# Altium schematic sheet 04_Power.SchDoc: =GlobalProjectName
size 594 x 420 mm; CheckedBy: A_D; Author: A_D; SheetNumber: 4; SheetTotal: 4; PageSetup: Record=PageOptions|CenterHorizontal=True|CenterVertical=True|PrintScale=0.70|XCorrection=1.00|YCorrection=1.00|PrintKind=2|BorderSize=5000000|LeftOffset=9000|BottomOffset=10100|Orientation=2|PaperLength=11176|PaperWidth=8636|Scale=100|PaperSource=259|PrintQuality=-3|MediaType=1|DitherType=10|PrintScaleMode=1|PaperKind=A3|PaperIndex=8
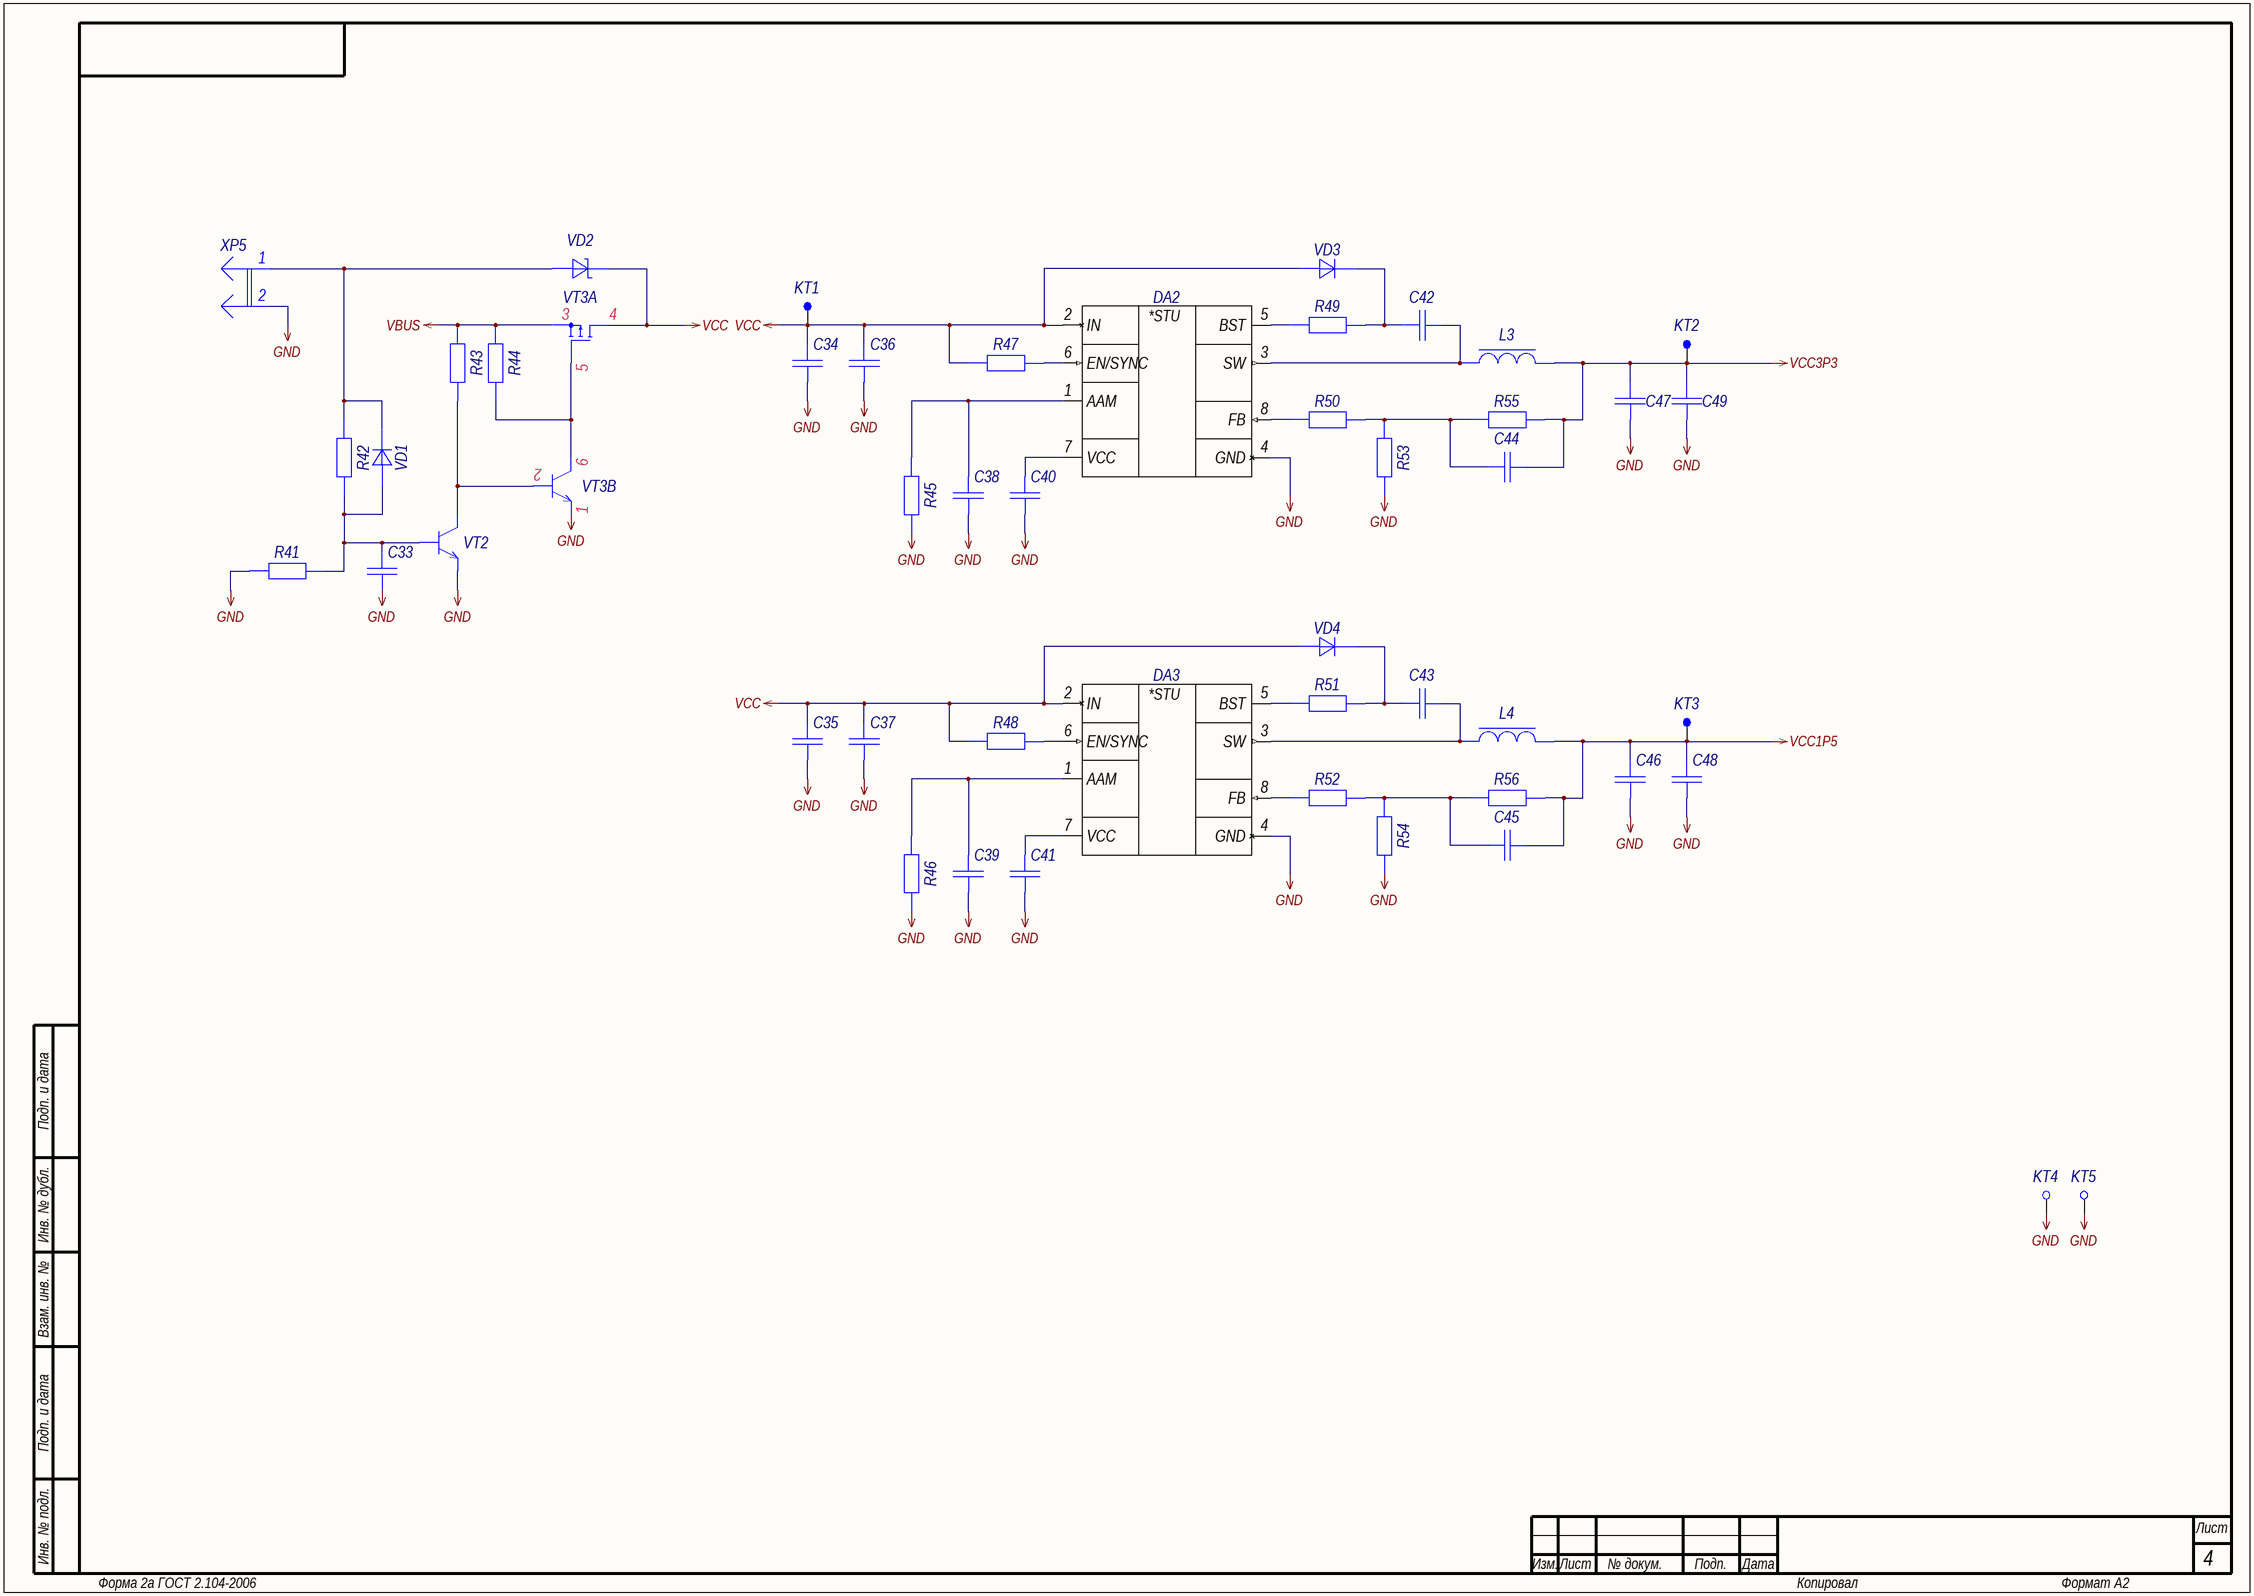
[diagram p0: 04_Power.SchDoc]

## Parts
C33  Capacitor  [C0603_L]  (value not drawn)
C34  Capacitor  [C1206_L]  (value not drawn)
C35  Capacitor  [C1206_L]  (value not drawn)
C36  Capacitor  [C0603_L]  (value not drawn)
C37  Capacitor  [C0603_L]  (value not drawn)
C38  Capacitor  [C0603_L]  (value not drawn)
C39  Capacitor  [C0603_L]  (value not drawn)
C40  Capacitor  [C0603_L]  (value not drawn)
C41  Capacitor  [C0603_L]  (value not drawn)
C42  Capacitor  [C0603_L]  (value not drawn)
C43  Capacitor  [C0603_L]  (value not drawn)
C44  Capacitor  [C0603_L]  (value not drawn)
C45  Capacitor  [C0603_L]  (value not drawn)
C46  Capacitor  [C0805_L]  (value not drawn)
C47  Capacitor  [C0805_L]  (value not drawn)
C48  Capacitor  [C0805_L]  (value not drawn)
C49  Capacitor  [C0805_L]  (value not drawn)
DA2  MP2315GJ  [TSOT-23-8_065P290X160X100_N]  (value not drawn)
DA3  MP2315GJ  [TSOT-23-8_065P290X160X100_N]  (value not drawn)
KT1  VCC  [TP-SMT-C-0.8mm]  (value not drawn)  (no BOM)
KT2  +3.3В  [TP-SMT-C-0.8mm]  (value not drawn)  (no BOM)
KT3  +1.5V  [TP-SMT-C-0.8mm]  (value not drawn)  (no BOM)
KT4  ОБЩ  [5001]  (value not drawn)  (no BOM)
KT5  ОБЩ  [5001]  (value not drawn)  (no BOM)
L3  Coil  [SRP4020TA-Series]  (value not drawn)
L4  Coil  [SRP4020TA-Series]  (value not drawn)
R41  Resistor  [R0603_L]  (value not drawn)
R42  Resistor  [R0603_L]  (value not drawn)
R43  Resistor  [R0603_L]  (value not drawn)
R44  Resistor  [R0603_L]  (value not drawn)
R45  Resistor  [R0603_L]  (value not drawn)
R46  Resistor  [R0603_L]  (value not drawn)
R47  Resistor  [R0603_L]  (value not drawn)
R48  Resistor  [R0603_L]  (value not drawn)
R49  Resistor  [R0603_L]  (value not drawn)
R50  Resistor  [R0603_L]  (value not drawn)
R51  Resistor  [R0603_L]  (value not drawn)
R52  Resistor  [R0603_L]  (value not drawn)
R53  Resistor  [R0603_L]  (value not drawn)
R54  Resistor  [R0603_L]  (value not drawn)
R55  Resistor  [R0603_L]  (value not drawn)
R56  Resistor  [R0603_L]  (value not drawn)
VD1  Diode  [SOD-323]  (value not drawn)
VD2  Schottky  [SOD-123]  (value not drawn)
VD3  Diode  [SOD-323]  (value not drawn)
VD4  Diode  [SOD-323]  (value not drawn)
VT2  BJT-NPN  [SOT-23_190P290X160X145_N]  (value not drawn)
VT3  PMC85XP  [SOT-1118-2M_065P200X200X065_N]  (value not drawn)  (parts A,B of 2)
XP5  VCC  [MW-2M]  (value not drawn)

## Nets
GND: C33.1 C34.1 C35.1 C36.1 C37.1 C38.1 C39.1 C40.1 C41.1 C46.1 C47.1 C48.1 C49.1 DA2.4(GND) DA3.4(GND) KT4.1 KT5.1 R41.2 R45.1 R46.1 R53.1 R54.1 VT2.3(Э) VT3.1(Э) XP5.2
VBUS: R43.2 R44.2 VT3.3(S)
VCC: C34.2 C35.2 C36.2 C37.2 DA2.2(IN) DA3.2(IN) KT1.1 R47.1 R48.1 VD2.2(К) VD3.1(А) VD4.1(А) VT3.4(D)
VCC1P5: C45.2 C46.2 C48.2 KT3.1 L4.2 R56.2
VCC3P3: C44.2 C47.2 C49.2 KT2.1 L3.2 R55.2
NetC33_2: C33.2 R41.1 R42.1 VD1.1(А) VT2.1(Б)
NetC38_2: C38.2 DA2.1(AAM) R45.2
NetC39_2: C39.2 DA3.1(AAM) R46.2
NetC40_2: C40.2 DA2.7(VCC)
NetC41_2: C41.2 DA3.7(VCC)
NetC42_1: C42.1 R49.2 VD3.2(К)
NetC42_2: C42.2 DA2.3(SW) L3.1
NetC43_1: C43.1 R51.2 VD4.2(К)
NetC43_2: C43.2 DA3.3(SW) L4.1
NetC44_1: C44.1 R50.2 R53.2 R55.1
NetC45_1: C45.1 R52.2 R54.2 R56.1
NetDA2_5: DA2.5(BST) R49.1
NetDA2_6: DA2.6(EN/SYNC) R47.2
NetDA2_8: DA2.8(FB) R50.1
NetDA3_5: DA3.5(BST) R51.1
NetDA3_6: DA3.6(EN/SYNC) R48.2
NetDA3_8: DA3.8(FB) R52.1
NetR42_2: R42.2 VD1.2(К) VD2.1(А) XP5.1
NetR43_1: R43.1 VT2.2(К) VT3.2(Б)
NetR44_1: R44.1 VT3.5(G) VT3.6(К)

## Notes on the sheet
- Подп. и дата
- Инв. № дубл.
- Взам. инв. №
- Инв. № подл.
- Изм.
- Лист
- № докум.
- Подп.
- Дата
- Форма 2а ГОСТ 2.104-2006
- Копировал
- Формат А2
- (in symbol MP2315GJ-Z) *STU

## Library data of the parts
C33 C36 C37 C40-C43 = GRM188R72A104KA35D: Manufacturer: Murata; Type: Конденсатор; ID: 232; Value: 0.1uF; Voltage: 100V; Tolerance: ±10%; Dielectric Type: X7R; Application Category: 1; Working Temperature Min: -55°С; Working Temperature Max: +125°С; Published: 18.05.2010; Publisher: Andrew Danich; Part Number: GRM188R72A104KA35D; Footprint: 0603
  C36 C37 C42 C43: ClassName: DirectConnect
C34 C35 = GRM31CR71A226KE15L: Manufacturer: Murata; Type: Конденсатор; ID: 238; Value: 22uF; Voltage: 10V; Tolerance: ±10%; Dielectric Type: X7R; Application Category: 1; Working Temperature Min: -55°С; Working Temperature Max: +125°С; Published: 18.05.2010; Publisher: Andrew Danich; Part Number: GRM31CR71A226KE15L; Footprint: 1206; ClassName: DirectConnect
C38 C39 = GRM1885C2A102JA01D: Manufacturer: Murata; Type: Конденсатор; ID: 135; Value: 1000pF; Voltage: 100V; Tolerance: ±5%; Dielectric Type: NP0; Application Category: 1; Working Temperature Min: -55°С; Working Temperature Max: +125°С; Published: 18.05.2010; Publisher: Andrew Danich; Part Number: GRM1885C2A102JA01D; Footprint: 0603
C44 C45 = GRM1885C1H330JA01D: Manufacturer: Murata; Type: Конденсатор; ID: 123; Value: 33pF; Voltage: 50V; Tolerance: ±5%; Dielectric Type: NP0; Application Category: 1; Working Temperature Min: -55°С; Working Temperature Max: +125°С; Published: 18.05.2010; Publisher: Andrew Danich; Part Number: GRM1885C1H330JA01D; Footprint: 0603
C46-C49 = GRM21BR60J226ME39L: Manufacturer: Murata; Type: Конденсатор; ID: 140; Value: 22uF; Voltage: 6.3V; Tolerance: ±20%; Dielectric Type: X5R; Application Category: 1; Working Temperature Min: -55°С; Working Temperature Max: +85°С; Published: 18.05.2010; Publisher: Andrew Danich; Part Number: GRM21BR60J226ME39L; Footprint: 0805; ClassName: DirectConnect
DA2 DA3 = MP2315GJ-Z: Manufacturer: Monolithic Power Systems; ID: 38; Input Voltage: +4.5…24V; Output Current: 3A; Output Voltage: +0.8…22.8V; Shutdown Input: YES; Frequency: 500kHz; Application Category: 1; Working Temperature Min: -40°С; Working Temperature Max: +125°С; Functional Analog: MP2315GJ-P; Type: Микросхема; Published: 01.09.2018; Publisher: Andrew Danich; Part Number: MP2315GJ-Z; Value: MP2315GJ-Z; ClassName: DirectConnect
KT1-KT3 = TestPoint-SMT: ID: 6; Application Type: On PCB Test Point; Application Category: 1; Published: 03.03.2015; Publisher: Andrew Danich; Part Number: TestPoint-SMT; Value: TestPoint-SMT; Manufacturer: -; Functional Analog: -
KT4 KT5 = 5001: Manufacturer: Keystone Electronics; ID: 2; Value: 5001; Limit Voltage: 100V; Rated Current: 0.5A; Application Type: Miniature THM Test Point; Application Category: 1; Published: 03.03.2015; Publisher: Andrew Danich; Part Number: 5001; Functional Analog: -
L3 L4 = SRP4020TA-4R7M: Manufacturer: Bourns; Type: Дроссель; ID: 103; Rated Current: 2.6A; Tolerance: ±20%; Inductance: 4.7uH; Q: 10; DC Resistance: 0.105ohm; Self-Resonant Frequency: 27MHz; Application Category: 1; Working Temperature Min: -40°С; Working Temperature Max: +125°С; Published: 20.05.2010; Publisher: Andrew Danich; Part Number: SRP4020TA-4R7M; Value: SRP4020TA-4R7M; Footprint: SRP4020TA; ClassName: DirectConnect
R41-R44 = RC0603JR-0710KL: Manufacturer: Yageo; ID: 12; Value: 10k; Limit Voltage: 50V; Tolerance: ±5%; Temperature Coefficient: 100ppm; Total Power Dissipation: 0.1W; Series Type: Thick-Film; Application Category: 1; Working Temperature Min: -55°С; Working Temperature Max: +155°С; Functional Analog: CR0603-JW-103E; Published: 24.03.2010; Publisher: Andrew Danich; Type: Резистор; Part Number: RC0603JR-0710KL; Footprint: 0603
R45 R46 = RC0603JR-0762KL: Manufacturer: Yageo; ID: 74; Value: 62k; Limit Voltage: 50V; Tolerance: ±5%; Temperature Coefficient: 100ppm; Total Power Dissipation: 0.1W; Series Type: Thick-Film; Application Category: 1; Working Temperature Min: -55°С; Working Temperature Max: +155°С; Published: 24.03.2010; Publisher: Andrew Danich; Type: Резистор; Part Number: RC0603JR-0762KL; Footprint: 0603
R47 R48 = RC0603JR-07100KL: Manufacturer: Yageo; ID: 11; Value: 100k; Limit Voltage: 50V; Tolerance: ±5%; Temperature Coefficient: 100ppm; Total Power Dissipation: 0.1W; Series Type: Thick-Film; Application Category: 1; Working Temperature Min: -55°С; Working Temperature Max: +155°С; Functional Analog: CR0603-JW-104E; Published: 24.03.2010; Publisher: Andrew Danich; Type: Резистор; Part Number: RC0603JR-07100KL; Footprint: 0603
R49 R51 = RC0603JR-0722RL: Manufacturer: Yageo; ID: 29; Value: 22; Limit Voltage: 50V; Tolerance: ±5%; Temperature Coefficient: 100ppm; Total Power Dissipation: 0.1W; Series Type: Thick-Film; Application Category: 1; Working Temperature Min: -55°С; Working Temperature Max: +155°С; Published: 24.03.2010; Publisher: Andrew Danich; Type: Резистор; Part Number: RC0603JR-0722RL; Footprint: 0603
R50 R52 = RC0603JR-0733KL: Manufacturer: Yageo; ID: 47; Value: 33k; Limit Voltage: 50V; Tolerance: ±5%; Temperature Coefficient: 100ppm; Total Power Dissipation: 0.1W; Series Type: Thick-Film; Application Category: 1; Working Temperature Min: -55°С; Working Temperature Max: +155°С; Published: 24.03.2010; Publisher: Andrew Danich; Type: Резистор; Part Number: RC0603JR-0733KL; Footprint: 0603
R53 = RC0603FR-0712K7L: Manufacturer: Yageo; ID: 263; Value: 12.7k; Limit Voltage: 50V; Tolerance: ±1%; Temperature Coefficient: 100ppm; Total Power Dissipation: 0.1W; Series Type: Thick-Film; Application Category: 1; Working Temperature Min: -55°С; Working Temperature Max: +155°С; Published: 24.03.2010; Publisher: Andrew Danich; Type: Резистор; Part Number: RC0603FR-0712K7L; Footprint: 0603
R54 = RC0603FR-0746K4L: Manufacturer: Yageo; ID: 298; Value: 46.4k; Limit Voltage: 50V; Tolerance: ±1%; Temperature Coefficient: 100ppm; Total Power Dissipation: 0.1W; Series Type: Thick-Film; Application Category: 1; Working Temperature Min: -55°С; Working Temperature Max: +155°С; Published: 24.03.2010; Publisher: Andrew Danich; Type: Резистор; Part Number: RC0603FR-0746K4L; Footprint: 0603
R55 R56 = RC0603FR-0740K2L: Manufacturer: Yageo; ID: 294; Value: 40.2k; Limit Voltage: 50V; Tolerance: ±1%; Temperature Coefficient: 100ppm; Total Power Dissipation: 0.1W; Series Type: Thick-Film; Application Category: 1; Working Temperature Min: -55°С; Working Temperature Max: +155°С; Published: 24.03.2010; Publisher: Andrew Danich; Type: Резистор; Part Number: RC0603FR-0740K2L; Footprint: 0603
VD1 VD3 VD4 = 1N4148WS-7-F: Manufacturer: Diodes Incorporated; Type: Диод; ID: 13; Reverse Voltage: 100V; Reverse Current: 1uA; Forward Voltage: 1V; Forward Current: 150mA; Total Power Dissipation: 200mW; Capacitance: 2pF; Recovery Time: 4nS; Application Category: 1; Working Temperature Min: -55°С; Working Temperature Max: +150°С; Published: 18.05.2010; Publisher: Andrew Danich; Part Number: 1N4148WS-7-F; Value: 1N4148WS-7-F; Functional Analog: 1N4148WS
VD2 = MBR0540T1G: Manufacturer: ON Semiconductor; Type: Диод; ID: 11; Reverse Voltage: 40V; Reverse Current: 250uA; Forward Voltage: 0.51V; Forward Current: 0.5A; Total Power Dissipation: 410mW; Capacitance: 170pF; Application Category: 1; Working Temperature Min: -55°С; Working Temperature Max: +150°С; Published: 18.05.2010; Publisher: Andrew Danich; Part Number: MBR0540T1G; Value: MBR0540T1G; Functional Analog: MBR0540; ClassName: DirectConnect
VT2 = BC846: Part Number: BC846; Type: Транзистор; ID: 9; Value: BC846; C-E Voltage: 65V; Collector Current: 100mA; C-E Saturation Voltage: 0.6V; DC Current Gain: 110…450; Total Power Dissipation: 250mW; Transition Frequency: 100MHz; Application Category: 1; Published: 07.05.2013; Publisher: Andrew Danich
VT3 = PMC85XP: Manufacturer: NXP Semiconductors; Type: Сборка транзисторная; ID: 33; D-S Voltage: -30V; Drain Current: -3.4A; D-S On-Resistance: 110momh; Gate Capacitance: 680pF; Total Power Dissipation: 1.17W; Gate Threshold Voltage: -1.2V; Application Category: 1; Working Temperature Min: -55°С; Working Temperature Max: +150°С; Published: 13.03.2017; Publisher: Andrew Danich; Part Number: PMC85XP; Value: PMC85XP; Functional Analog: -; ClassName: DirectConnect
XP5 = MW-2M: Value: MW-2M; ID: 60; Limit Voltage: 100V; Limit Current: 2A; Connector Type: Male; Resistance: 20mohm; Surface Finish: Phosphor Bronze; Pitch: 2mm; Application Category: 1; Published: 07.03.2013; Publisher: Andrew Danich; Type: Вилка; Part Number: MW-2M; Pins: 2